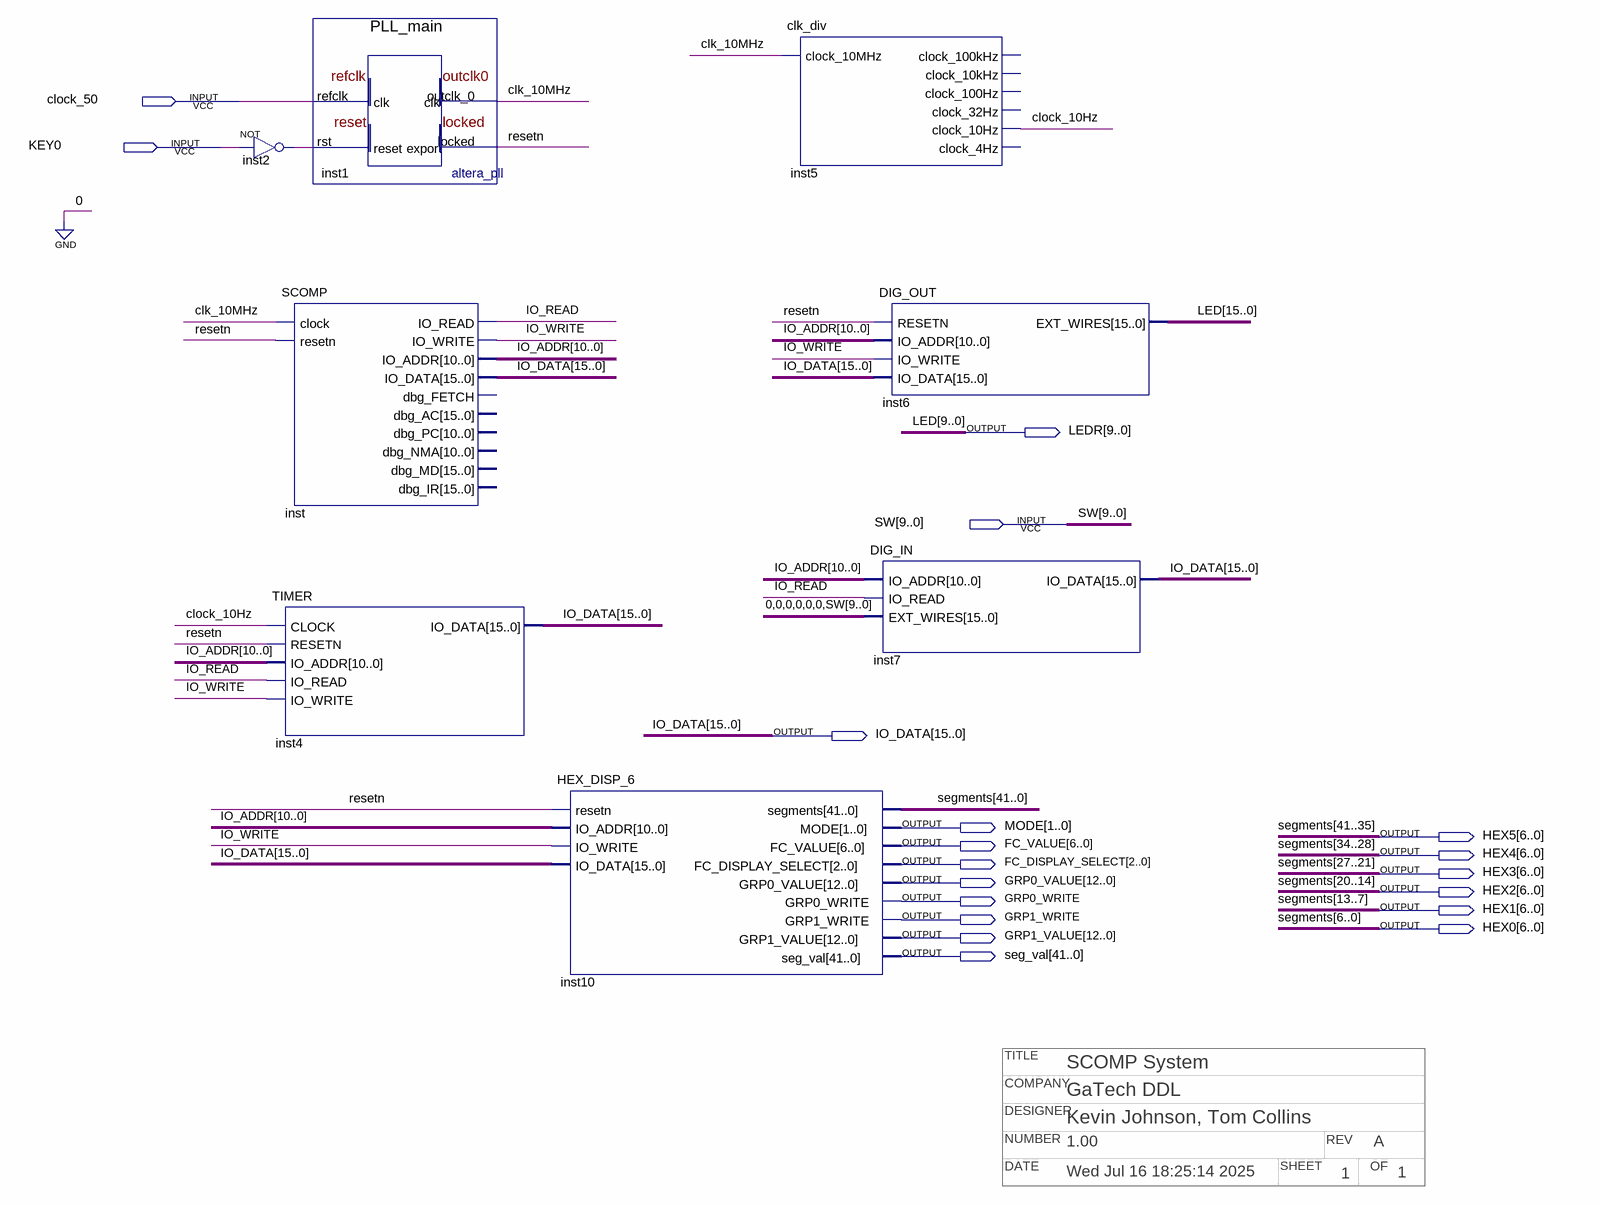
[diagram p0: schematic sheet]
// Quartus schematic SCOMP_System.bdf as structural Verilog: 8 symbols, 19 pins
// Title block: TITLE: SCOMP System; COMPANY: GaTech DDL; DESIGNER: Kevin Johnson, Tom Collins; NUMBER: 1.00; REV: A; DATE: Wed Jul 16 18:25:14 2025; SHEET: 1; OF: 1
module SCOMP_System (
  input  clock_50,
  input  KEY0,
  input  [9:0] SW,
  output [9:0] LEDR,
  output [15:0] IO_DATA,
  output [1:0] MODE,
  output [6:0] HEX5,
  output [6:0] FC_VALUE,
  output [6:0] HEX4,
  output [2:0] FC_DISPLAY_SELECT,
  output [6:0] HEX3,
  output [12:0] GRP0_VALUE,
  output [6:0] HEX2,
  output GRP0_WRITE,
  output [6:0] HEX1,
  output GRP1_WRITE,
  output [6:0] HEX0,
  output [12:0] GRP1_VALUE,
  output [41:0] seg_val
);

  wire clk_10MHz, clock_10Hz, inst2_out, IO_READ, IO_WRITE, resetn;
  wire [10:0] IO_ADDR;
  wire [15:10] LED;

  not inst2 (inst2_out, KEY0);
  SCOMP inst (
    .clock(clk_10MHz), .resetn(resetn), .IO_READ(IO_READ), .IO_WRITE(IO_WRITE), .IO_ADDR(IO_ADDR),
    .IO_DATA(IO_DATA));  // open: dbg_FETCH, dbg_AC, dbg_PC, dbg_NMA, dbg_MD, dbg_IR
  TIMER inst4 (
    .CLOCK(clock_10Hz), .RESETN(resetn), .IO_ADDR(IO_ADDR), .IO_READ(IO_READ), .IO_WRITE(IO_WRITE),
    .IO_DATA(IO_DATA));
  PLL_main inst1 (.refclk(clock_50), .rst(inst2_out), .outclk_0(clk_10MHz), .locked(resetn));
  HEX_DISP_6 inst10 (
    .resetn(resetn), .IO_ADDR(IO_ADDR), .IO_WRITE(IO_WRITE), .IO_DATA(IO_DATA),
    .segments({HEX5, HEX4, HEX3, HEX2, HEX1, HEX0}), .MODE(MODE), .FC_VALUE(FC_VALUE),
    .FC_DISPLAY_SELECT(FC_DISPLAY_SELECT), .GRP0_VALUE(GRP0_VALUE), .GRP0_WRITE(GRP0_WRITE),
    .GRP1_WRITE(GRP1_WRITE), .GRP1_VALUE(GRP1_VALUE), .seg_val(seg_val));
  clk_div inst5 (
    .clock_10MHz(clk_10MHz), .clock_10Hz(clock_10Hz));  // open: clock_100kHz, clock_10kHz, clock_100Hz, clock_32Hz, clock_4Hz
  DIG_IN inst7 (.IO_ADDR(IO_ADDR), .IO_READ(IO_READ), .EXT_WIRES({{6{1'b0}}, SW}), .IO_DATA(IO_DATA));
  DIG_OUT inst6 (.RESETN(resetn), .IO_ADDR(IO_ADDR), .IO_WRITE(IO_WRITE), .IO_DATA(IO_DATA), .EXT_WIRES({LED, LEDR}));

  // Other names for the same wires on the sheet: LED[9:0] = LEDR;
  //   segments[41:0] = {HEX5, HEX4, HEX3, HEX2, HEX1, HEX0}
endmodule
